# EAGLE design Wordclock-back-smd (EAGLE 6.0)
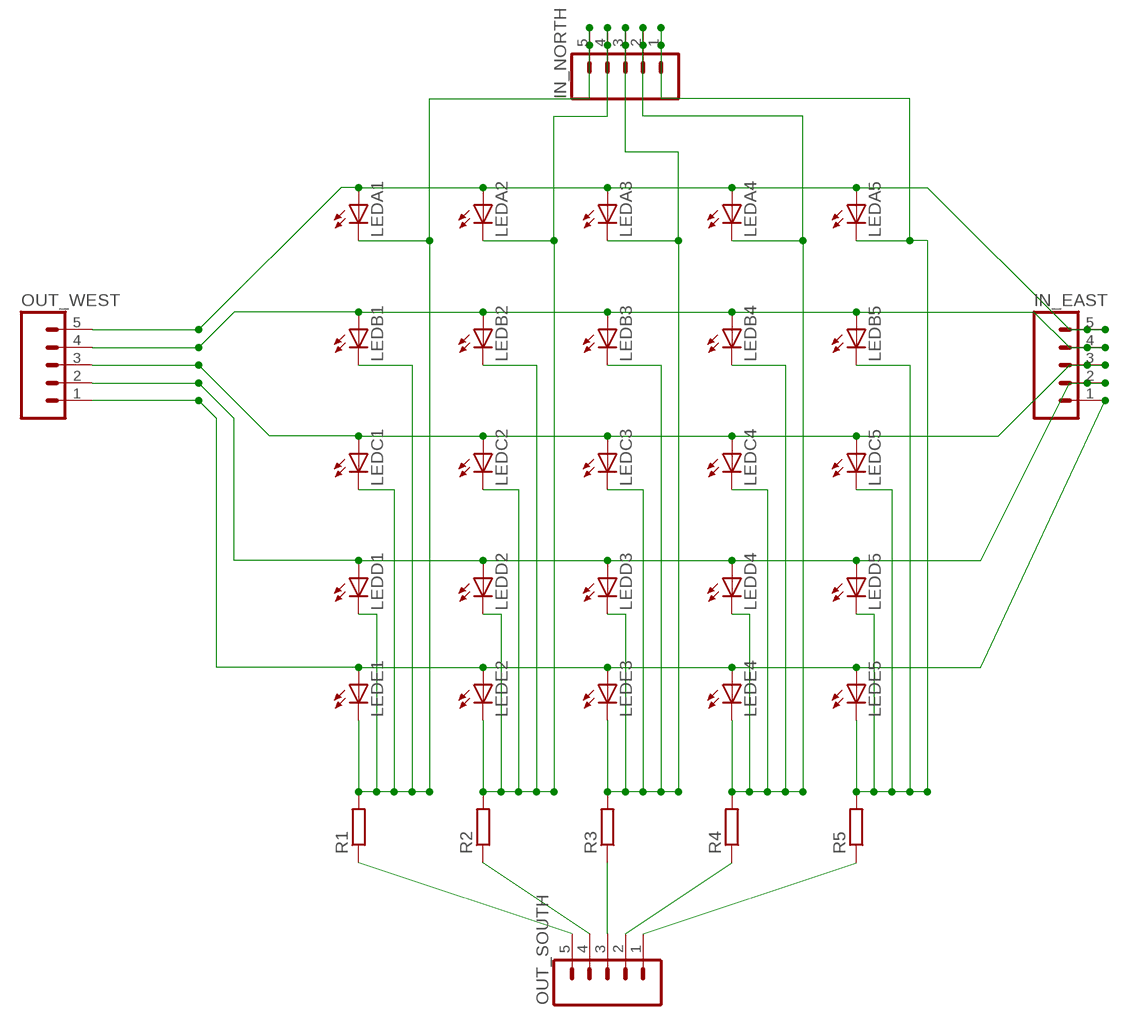
[diagram p0: schematic, sheet 1]

## Parts
IN_EAST  M05PTH  [1X05]
IN_NORTH  M05PTH  [1X05]
LEDA1  LEDKA-3528ASYC  [KA-3528ASYC]
LEDA2  LEDKA-3528ASYC  [KA-3528ASYC]
LEDA3  LEDKA-3528ASYC  [KA-3528ASYC]
LEDA4  LEDKA-3528ASYC  [KA-3528ASYC]
LEDA5  LEDKA-3528ASYC  [KA-3528ASYC]
LEDB1  LEDKA-3528ASYC  [KA-3528ASYC]
LEDB2  LEDKA-3528ASYC  [KA-3528ASYC]
LEDB3  LEDKA-3528ASYC  [KA-3528ASYC]
LEDB4  LEDKA-3528ASYC  [KA-3528ASYC]
LEDB5  LEDKA-3528ASYC  [KA-3528ASYC]
LEDC1  LEDKA-3528ASYC  [KA-3528ASYC]
LEDC2  LEDKA-3528ASYC  [KA-3528ASYC]
LEDC3  LEDKA-3528ASYC  [KA-3528ASYC]
LEDC4  LEDKA-3528ASYC  [KA-3528ASYC]
LEDC5  LEDKA-3528ASYC  [KA-3528ASYC]
LEDD1  LEDKA-3528ASYC  [KA-3528ASYC]
LEDD2  LEDKA-3528ASYC  [KA-3528ASYC]
LEDD3  LEDKA-3528ASYC  [KA-3528ASYC]
LEDD4  LEDKA-3528ASYC  [KA-3528ASYC]
LEDD5  LEDKA-3528ASYC  [KA-3528ASYC]
LEDE1  LEDKA-3528ASYC  [KA-3528ASYC]
LEDE2  LEDKA-3528ASYC  [KA-3528ASYC]
LEDE3  LEDKA-3528ASYC  [KA-3528ASYC]
LEDE4  LEDKA-3528ASYC  [KA-3528ASYC]
LEDE5  LEDKA-3528ASYC  [KA-3528ASYC]
OUT_SOUTH  M05PTH  [1X05]
OUT_WEST  M05PTH  [1X05]
R1  R-EU_0207/10  [0207/10]
R2  R-EU_0207/10  [0207/10]
R3  R-EU_0207/10  [0207/10]
R4  R-EU_0207/10  [0207/10]
R5  R-EU_0207/10  [0207/10]

## Nets
N$1: IN_NORTH.5 LEDA1.C LEDB1.C LEDC1.C LEDD1.C LEDE1.C R1.2
N$2: IN_NORTH.4 LEDA2.C LEDB2.C LEDC2.C LEDD2.C LEDE2.C R2.2
N$3: IN_NORTH.3 LEDA3.C LEDB3.C LEDC3.C LEDD3.C LEDE3.C R3.2
N$4: IN_NORTH.2 LEDA4.C LEDB4.C LEDC4.C LEDD4.C LEDE4.C R4.2
N$5: IN_NORTH.1 LEDA5.C LEDB5.C LEDC5.C LEDD5.C LEDE5.C R5.2
N$6: OUT_SOUTH.1 R5.1
N$12: OUT_SOUTH.2 R4.1
N$13: OUT_SOUTH.3 R3.1
N$14: OUT_SOUTH.4 R2.1
N$15: OUT_SOUTH.5 R1.1
N$16: IN_EAST.5 LEDA1.A LEDA2.A LEDA3.A LEDA4.A LEDA5.A OUT_WEST.5
N$17: IN_EAST.4 LEDB1.A LEDB2.A LEDB3.A LEDB4.A LEDB5.A OUT_WEST.4
N$18: IN_EAST.3 LEDC1.A LEDC2.A LEDC3.A LEDC4.A LEDC5.A OUT_WEST.3
N$19: IN_EAST.2 LEDD1.A LEDD2.A LEDD3.A LEDD4.A LEDD5.A OUT_WEST.2
N$20: IN_EAST.1 LEDE1.A LEDE2.A LEDE3.A LEDE4.A LEDE5.A OUT_WEST.1

## Library data of the parts
IN_EAST IN_NORTH OUT_SOUTH OUT_WEST = SparkFun:M05: Header 5 Standard 5-pin 0.1" header. Use with straight break away headers (SKU : PRT-00116), right angle break away headers (PRT-00553), swiss pins (PRT-00743), machine pins (PRT-00117), and female headers (PRT-00115). Molex polarized connector foot print use with SKU : PRT-08230 with associated crimp pins and housings.
LEDA1-LEDA5 LEDB1-LEDB5 LEDC1-LEDC5 LEDD1-LEDD5 LEDE1-LEDE5 = led:LED: LED OSRAM: - CHIPLED LG R971, LG N971, LY N971, LG Q971, LY Q971, LO R971, LY R971 LH N974, LH R974 LS Q976, LO Q976, LY Q976 LO Q996 - Hyper CHIPLED LW Q18S LB Q993, LB Q99A, LB R99A - SideLED LS A670, LO A670, LY A670, LG A670, LP A670 LB A673, LV A673, LT A673, LW A673 LH A674 LY A675 LS A676, LA A676, LO A676, LY A676, LW A676 LS A679, LY A679, LG A679 - Hyper Micro SIDELED® LS Y876, LA Y876, LO Y876, LY Y876 LT Y87S - SmartLED LW L88C, LW L88S LB L89C, LB L89S, LG L890 LS L89K, LO L89K, LY L89K LS L896, LA L896, LO L896, LY L896 - TOPLED LS T670, LO T670, LY T670, LG T670, LP T670 LSG T670, LSP T670, LSY T670, LOP T670, LYG T670 LG T671, LOG T671, LSG T671 LB T673, LV T673, LT T673, LW T673 LH T674 LS T676, LA T676, LO T676, LY T676, LB T676, LH T676, LSB T676, LW T676 LB T67C, LV T67C, LT T67C, LS T67K, LO T67K, LY T67K, LW E67C LS E67B, LA E67B, LO E67B, LY E67B, LB E67C, LV E67C, LT E67C LW T67C LS T679, LY T679, LG T679 LS T770, LO T770, LY T770, LG T770, LP T770 LB T773, LV T773, LT T773, LW T773 LH T774 LS E675, LA E675, LY E675, LS T675 LS T776, LA T776, LO T776, LY T776, LB T776 LHGB T686 LT T68C, LB T68C - Hyper Mini TOPLED® LB M676 - Mini TOPLED Santana® LG M470 LS M47K, LO M47K, LY M47K Source: http://www.osram.convergy.de LUXEON: - LUMILED® LXK2-PW12-R00, LXK2-PW12-S00, LXK2-PW14-U00, LXK2-PW14-V00 LXK2-PM12-R00, LXK2-PM12-S00, LXK2-PM14-U00 LXK2-PE12-Q00, LXK2-PE12-R00, LXK2-PE12-S00, LXK2-PE14-T00, LXK2-PE14-U00 LXK2-PB12-K00, LXK2-PB12-L00, LXK2-PB12-M00, LXK2-PB14-N00, LXK2-PB14-P00, LXK2-PB14-Q00 LXK2-PR12-L00, LXK2-PR12-M00, LXK2-PR14-Q00, LXK2-PR14-R00 LXK2-PD12-Q00, LXK2-PD12-R00, LXK2-PD12-S00 LXK2-PH12-R00, LXK2-PH12-S00 LXK2-PL12-P00, LXK2-PL12-Q00, LXK2-PL12-R00 Source: www.luxeon.com KINGBRIGHT: KA-3528ASYC Source: www.kingbright.com
R1-R5 = resistor:R-EU_: RESISTOR, European symbol

## Board
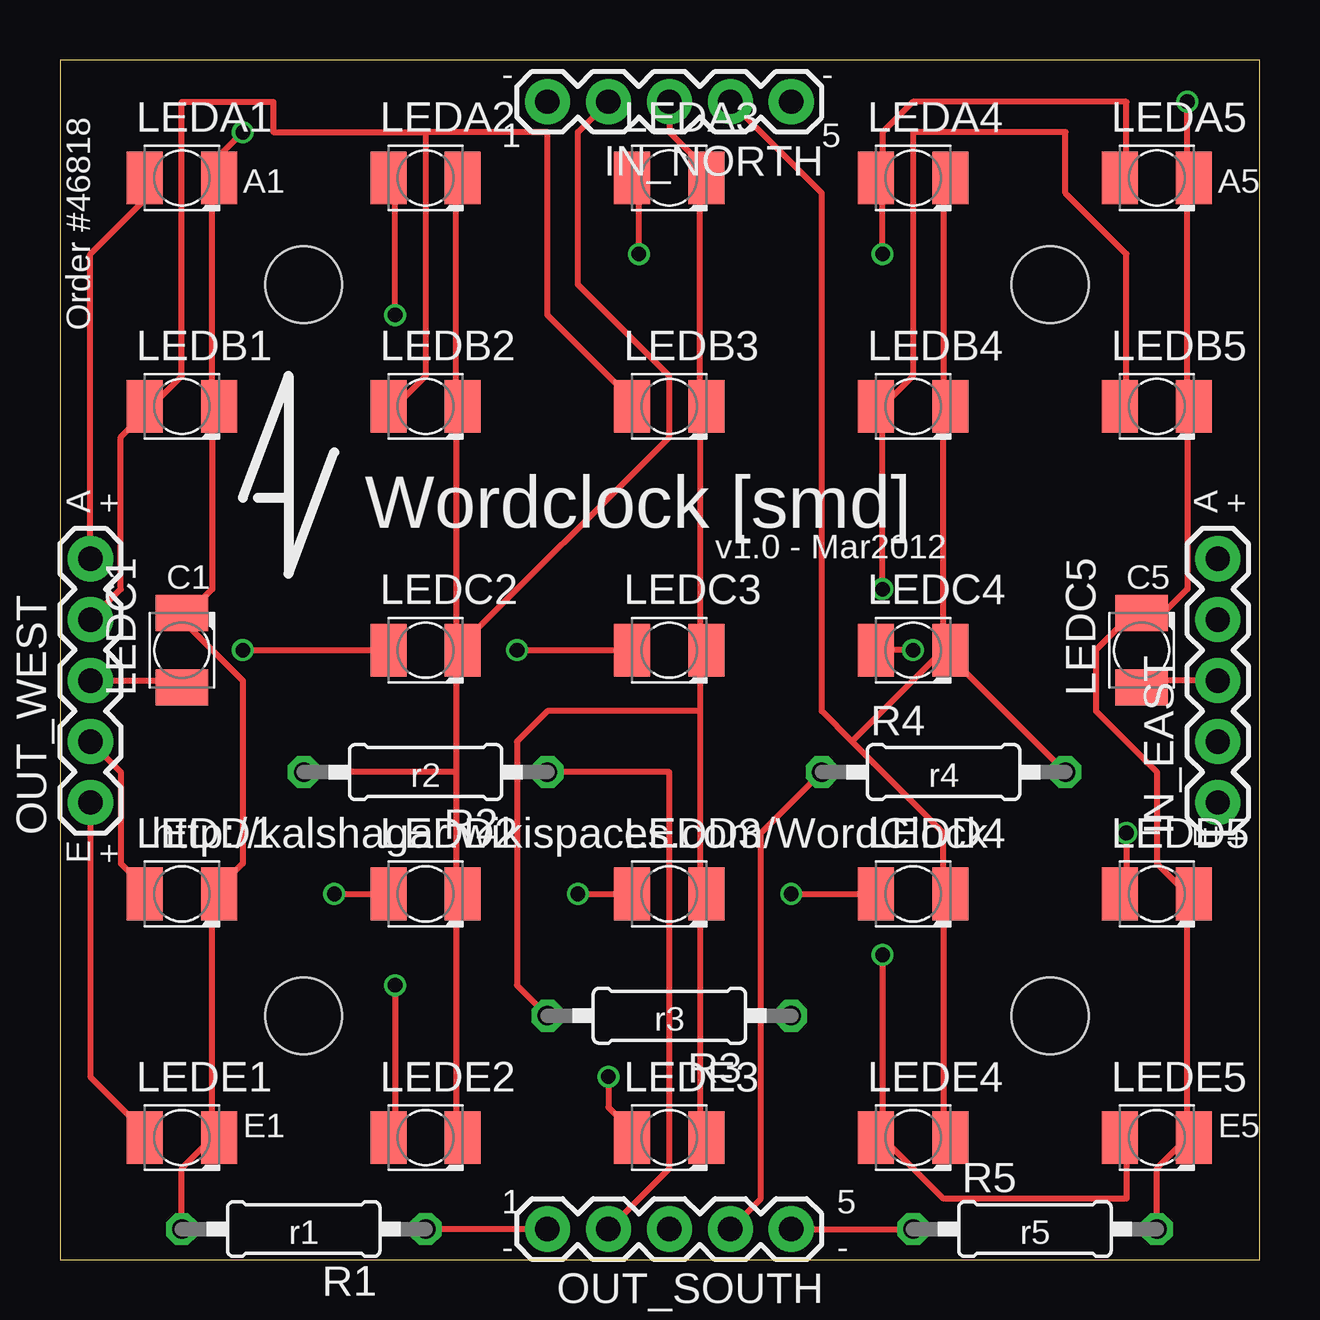
[diagram p1: board, top side]
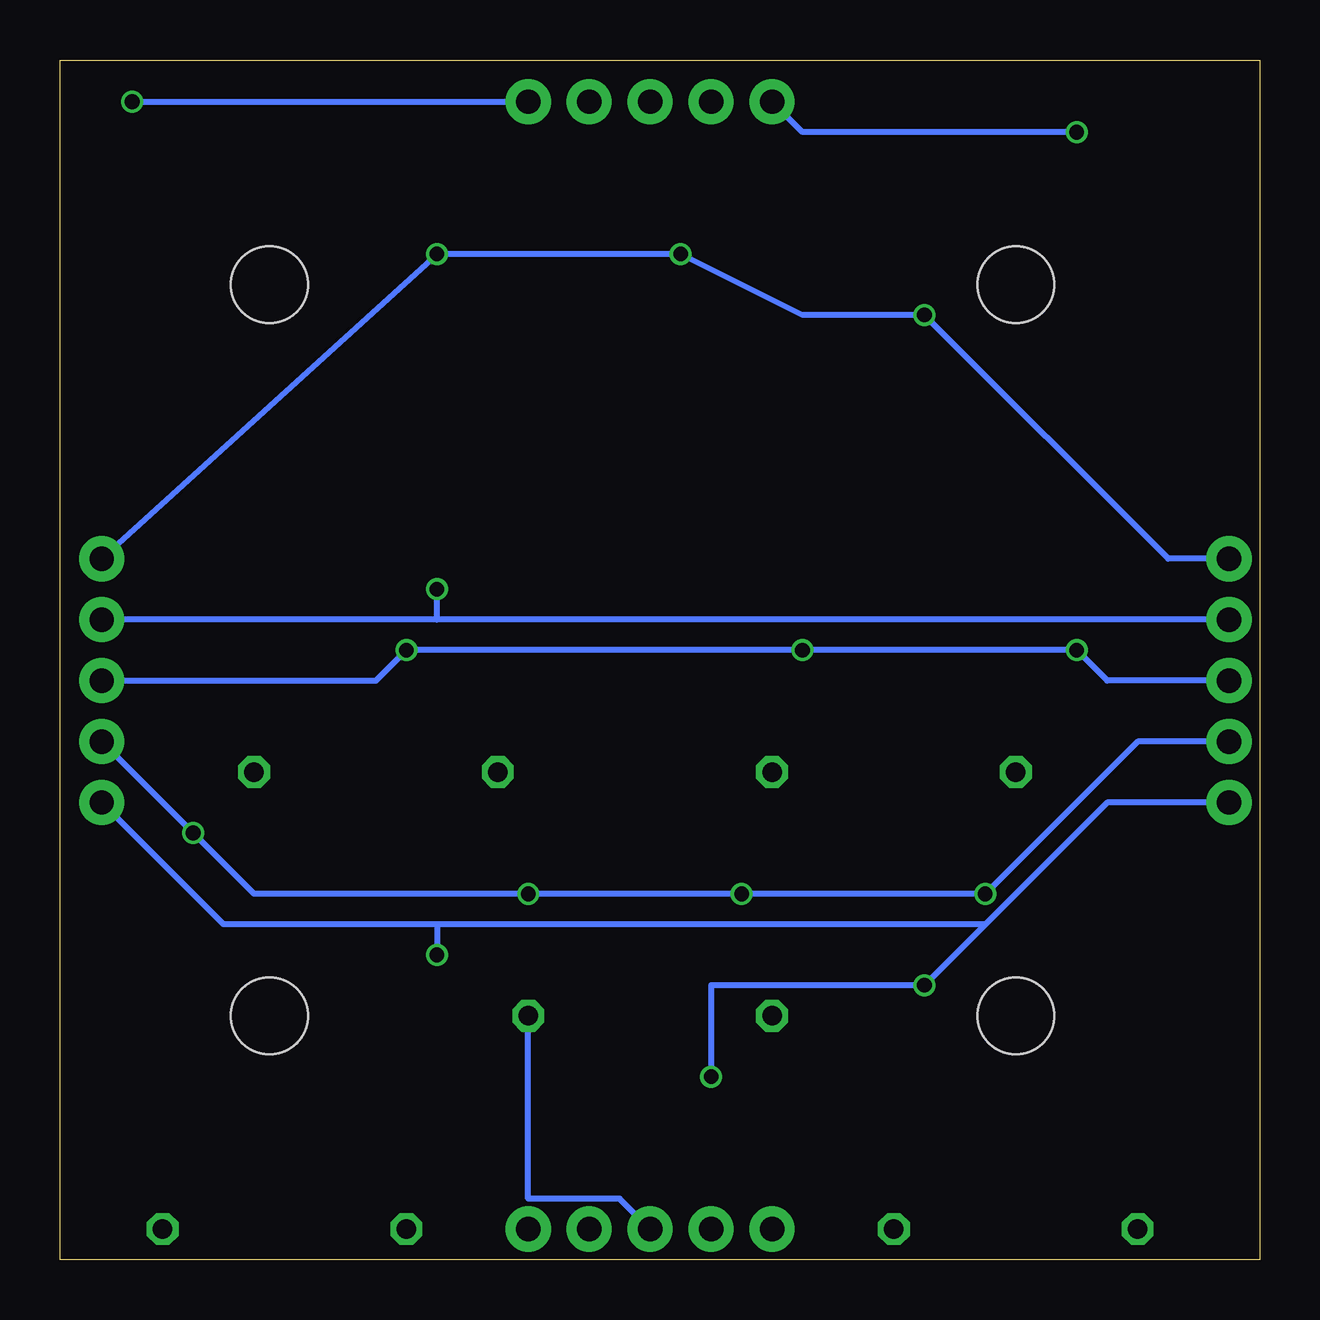
[diagram p2: board, bottom side, seen from below]

Size 50 x 50 mm. Coordinates in mm from the lower left corner, seen from the top.
Outline: 0,0 50,0 50,50 0,50 0,0
Copper layers (1*16): Top 0.035mm / dielectric 1.5mm / Bottom 0.035mm
Design rules: minimum track width 6mil, minimum drill 12mil, track to track 6mil, track to pad 6mil, pad to pad 6mil, via to via 6mil, smd to smd 0mil, copper to edge 10mil, drill to drill 10mil, minimum pad ring 10mil, minimum via ring 6mil, stop-mask expansion 2mil, vias tented up to drill 100mil, thermal gap 10mil
Holes 3.2 mm at 10.16,40.64 41.27,40.64 10.16,10.16 41.27,10.16

### Footprints (pad centres in the part's own frame; a part is rotated, then mirrored left to right if it is on the bottom)
1X05 = drill 1.016 pad 1.88: 1 0,0; 2 2.54,0; 3 5.08,0; 4 7.62,0; 5 10.16,0
KA-3528ASYC = smd 1.5 x 2.2: A -1.55,0; C 1.55,0
0207/10 = drill 0.813 octagon: 1 -5.08,0; 2 5.08,0

### Placement (x,y rotation side)
IN_EAST  48.26,19.05 90 top
IN_NORTH  30.48,48.26 180 top
LEDA1  5.08,45.09 0 top
LEDA2  15.24,45.09 0 top
LEDA3  25.4,45.09 0 top
LEDA4  35.56,45.09 0 top
LEDA5  45.72,45.09 0 top
LEDB1  5.08,35.56 0 top
LEDB2  15.24,35.56 0 top
LEDB3  25.4,35.56 0 top
LEDB4  35.56,35.56 0 top
LEDB5  45.72,35.56 0 top
LEDC1  5.08,25.4 90 top
LEDC2  15.24,25.4 0 top
LEDC3  25.4,25.4 0 top
LEDC4  35.56,25.4 0 top
LEDC5  45.09,25.4 90 top
LEDD1  5.08,15.24 0 top
LEDD2  15.24,15.24 0 top
LEDD3  25.4,15.24 0 top
LEDD4  35.56,15.24 0 top
LEDD5  45.72,15.24 0 top
LEDE1  5.08,5.08 0 top
LEDE2  15.24,5.08 0 top
LEDE3  25.4,5.08 0 top
LEDE4  35.56,5.08 0 top
LEDE5  45.72,5.08 0 top
OUT_SOUTH  30.48,1.27 180 top
OUT_WEST  1.27,19.05 90 top
R1  10.16,1.27 180 top
R2  15.24,20.32 180 top
R3  25.4,10.16 180 top
R4  36.83,20.32 0 top
R5  40.64,1.27 0 top

### Tracks (layer width: path | path; a pad name or v marks a point on that pad's centre or on a via)
N$1  (via drill 0.61)
  Top 0.254: 6.35,5.08 5.08,3.81 R1.2 | 6.35,5.08 6.35,15.24 | 6.35,5.08 LEDE1.C | 5.08,26.67 6.35,27.94 6.35,35.56 | 6.35,35.56 6.35,44.45 LEDA1.C 6.35,45.72 v7.62,46.99 | 6.35,35.56 LEDB1.C | 6.35,15.24 7.62,16.51 7.62,24.13 5.08,26.67 | 6.35,15.24 LEDD1.C | 5.08,26.67 LEDC1.C
  Bottom 0.254: IN_NORTH.5 19.05,46.99 v7.62,46.99
N$2
  Top 0.254: 16.51,15.24 16.51,5.08 LEDE2.C | 16.51,35.56 16.51,25.4 | 16.51,35.56 16.51,44.45 LEDA2.C | 16.51,35.56 LEDB2.C | 16.51,20.32 R2.2 | 16.51,25.4 16.51,20.32 | IN_NORTH.4 21.59,46.99 21.59,40.64 25.4,36.83 25.4,34.29 16.51,25.4 | 16.51,25.4 LEDC2.C | 16.51,20.32 16.51,15.24 | 16.51,15.24 LEDD2.C
N$3
  Top 0.254: 26.67,15.24 26.67,5.08 LEDE3.C | IN_NORTH.3 25.4,46.99 26.67,45.72 LEDA3.C 26.67,44.45 26.67,35.56 | 26.67,35.56 26.67,25.4 | R3.2 19.05,11.43 19.05,21.59 20.32,22.86 26.67,22.86 | 26.67,25.4 26.67,22.86 | 26.67,25.4 LEDC3.C | 26.67,35.56 LEDB3.C | 26.67,22.86 26.67,15.24 | 26.67,15.24 LEDD3.C
N$4
  Top 0.254: 36.83,35.56 36.83,44.45 LEDA4.C | R4.2 36.83,25.4 | 36.83,25.4 36.83,35.56 | 36.83,35.56 LEDB4.C | 36.83,15.24 36.83,5.08 LEDE4.C | IN_NORTH.2 31.75,44.45 31.75,22.86 33.02,21.59 | 33.02,21.59 36.83,17.78 36.83,15.24 | 36.83,15.24 LEDD4.C | 33.02,21.59 36.83,25.4 | 36.83,25.4 LEDC4.C
N$5  (via drill 0.61)
  Top 0.254: 46.99,5.08 45.72,3.81 R5.2 | 46.99,5.08 46.99,15.24 | 46.99,5.08 LEDE5.C | 46.99,35.56 46.99,27.94 45.72,26.67 LEDC5.C 44.45,26.67 43.18,25.4 43.18,22.86 45.72,20.32 45.72,16.51 46.99,15.24 | 46.99,35.56 46.99,44.45 LEDA5.C 46.99,45.72 v46.99,48.26 | 46.99,35.56 LEDB5.C | 46.99,15.24 LEDD5.C
  Bottom 0.254: v46.99,48.26 IN_NORTH.1
N$6
  Top 0.254: OUT_SOUTH.1 R5.1
N$12
  Top 0.254: R4.1 29.21,17.78 29.21,2.54 OUT_SOUTH.2
N$13
  Bottom 0.254: R3.1 30.48,2.54 26.67,2.54 OUT_SOUTH.3
N$14
  Top 0.254: R2.1 25.4,20.32 25.4,3.81 OUT_SOUTH.4
N$15
  Top 0.254: OUT_SOUTH.5 R1.1
N$16  (via drill 0.61)
  Top 0.254: LEDA5.A 44.45,45.72 44.45,48.26 35.56,48.26 34.29,46.99 34.29,45.72 LEDA4.A 34.29,44.45 v34.29,41.91 | OUT_WEST.5 1.27,41.91 3.81,44.45 LEDA1.A | v13.97,39.37 13.97,44.45 LEDA2.A | v24.13,41.91 24.13,44.45 LEDA3.A
  Bottom 0.254: OUT_WEST.5 3.81,29.21 v13.97,39.37 19.05,39.37 v24.13,41.91 v34.29,41.91 IN_EAST.5
N$17  (via drill 0.61)
  Top 0.254: 34.29,35.56 35.56,36.83 35.56,46.99 41.91,46.99 41.91,44.45 44.45,41.91 44.45,35.56 LEDB5.A | 15.24,46.99 15.24,36.83 13.97,35.56 LEDB2.A | 15.24,46.99 20.32,46.99 20.32,39.37 24.13,35.56 LEDB3.A | 3.81,35.56 2.54,34.29 2.54,27.94 OUT_WEST.4 | 15.24,46.99 8.89,46.99 8.89,48.26 5.08,48.26 5.08,36.83 3.81,35.56 | 3.81,35.56 LEDB1.A | v34.29,27.94 34.29,35.56 | 34.29,35.56 LEDB4.A
  Bottom 0.254: OUT_WEST.4 34.29,26.67 | 34.29,26.67 IN_EAST.4 | 34.29,26.67 v34.29,27.94
N$18  (via drill 0.61)
  Top 0.254: v35.56,25.4 LEDC4.A | IN_EAST.3 45.72,24.13 LEDC5.A | OUT_WEST.3 5.08,24.13 LEDC1.A | v7.62,25.4 LEDC2.A 13.97,25.4 | v19.05,25.4 LEDC3.A 24.13,25.4
  Bottom 0.254: IN_EAST.3 36.83,24.13 v35.56,25.4 v19.05,25.4 v7.62,25.4 6.35,24.13 OUT_WEST.3
N$19  (via drill 0.61)
  Top 0.254: v44.45,17.78 44.45,15.24 LEDD5.A | OUT_WEST.2 2.54,20.32 2.54,16.51 3.81,15.24 LEDD1.A | v11.43,15.24 LEDD2.A 13.97,15.24 | v21.59,15.24 LEDD3.A 24.13,15.24 | v30.48,15.24 LEDD4.A 34.29,15.24
  Bottom 0.254: IN_EAST.2 v44.45,17.78 41.91,15.24 v30.48,15.24 v21.59,15.24 v11.43,15.24 5.08,21.59 OUT_WEST.2
N$20  (via drill 0.61)
  Top 0.254: 34.29,5.08 36.83,2.54 44.45,2.54 44.45,5.08 LEDE5.A | OUT_WEST.1 1.27,7.62 3.81,5.08 LEDE1.A | v13.97,11.43 13.97,5.08 LEDE2.A | v22.86,7.62 22.86,6.35 24.13,5.08 LEDE3.A | v34.29,12.7 34.29,5.08 | 34.29,5.08 LEDE4.A
  Bottom 0.254: 11.43,13.97 6.35,19.05 OUT_WEST.1 | 11.43,13.97 v13.97,11.43 22.86,11.43 v22.86,7.62 | IN_EAST.1 43.18,13.97 34.29,13.97 | 11.43,13.97 34.29,13.97 | 34.29,13.97 v34.29,12.7

### Text on the board
_tNames: - | - | 1 | 5 | A1 | A5 | Order #46818 | A | + | A | + | Wordclock [smd] | v1.0 - Mar2012 | C1 | C5 | r2 | r4 | E | + | http://kalshagar.wikispaces.com/WordClock | E | + | r3 | E1 | E5 | 1 | 5 | r1 | r5 | - | -